# Altium schematic sheet Fastino_DAC_Series_Termination.SchDoc: Fastino
size 420 x 297 mm; Author: G.Kasprowicz; CompanyName: WUT ISE; DrawnBy: G.Kasprowicz; Organization: WUT ISE; Address1: PW ISE; Address2: Nowowiejska 15/19 00-665 Warsaw; Address3: gkasprow@gmail.com; Revision: 2; SheetNumber: 9; SheetTotal: 12; ModifiedBy: -; CheckedDate: -; Title2: Series termination; DivGrp: WUT ISE; Designer: G.Kasprowicz; ModifiedDate: -; ProjectName: Sensor Box
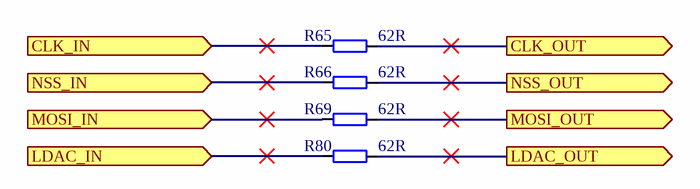
[diagram p0: Fastino_DAC_Series_Termination.SchDoc]

## Parts
R65  62R  [RESC0603X26N]
R66  62R  [RESC0603X26N]
R69  62R  [RESC0603X26N]
R80  62R  [RESC0603X26N]

## Ports
CLK_IN (in), CLK_OUT (out), LDAC_IN (in), LDAC_OUT (out), MOSI_IN (in), MOSI_OUT (out), NSS_IN (in), NSS_OUT (out)

## Nets
CLK_IN: R65.1 ; port CLK_IN
CLK_OUT: R65.2 ; port CLK_OUT
LDAC_IN: R80.1 ; port LDAC_IN
LDAC_OUT: R80.2 ; port LDAC_OUT
MOSI_IN: R69.1 ; port MOSI_IN
MOSI_OUT: R69.2 ; port MOSI_OUT
NSS_IN: R66.1 ; port NSS_IN
NSS_OUT: R66.2 ; port NSS_OUT

## Notes on the sheet
- Project/Equipment
- Document
- Designer
- Drawn by
- Check.by
- Copyright WUT ISE 2024.
  This documentation describes Open Hardware and is licensed under the CERN OHL v.2. You may redistribute and modify this documentation under the terms of the CERN OHL v.2. (http://ohwr.org/CERNOHL). This documentation is distributed WITHOUT ANY EXPRESS OR IMPLIED WARRANTY, INCLUDING OF MERCHANTABILITY, SATISFACTORY QUALITY AND FITNESS FOR A PARTICULAR PURPOSE. Please see the CERN OHL v.2 for applicable conditions.
- Contact
- File
- Last Mod.
- Print Date
- Sheet
- Size
- A3
- of
- Rev

## Library data of the parts
R65 R66 R69 R80 = R0201_62R_1%_0.05W_200PPM: Resistor - 1%; Manufacturer: GENERIC; Manufacturer1 Part Number: ERJ-1GNF62R0C; Part Description: Thick Film Chip Resistor; Power: 0.05W; TC: ±200ppm/°C; PressFit: No; Part Number: R0201_62R_1%_0.05W_200PPM; Manufacturer Part Number: R0201_62R_1%_0.05W_200PPM; Value: 62R; Tolerance: ±1%; Case: 0201; Component Type: Standard; Manufacturer1 ComponentHeight: 0.23mm; Manufacturer1 Example: Panasonic; Mounted: Yes; Component Kind: Standard; Pin Count: 2; Status: None; Sense: No; Socket: No; SMD: Yes; ComponentHeight: 0.27mm; HelpURL: \\cern.ch\dfs\Applications\Altium\Datasheets\R0201_VISHAY_TNPR e3.pdf; Author: CERN DEM HF; CreateDate: 27.08.2024; LatestRevisionDate: 27.08.2024